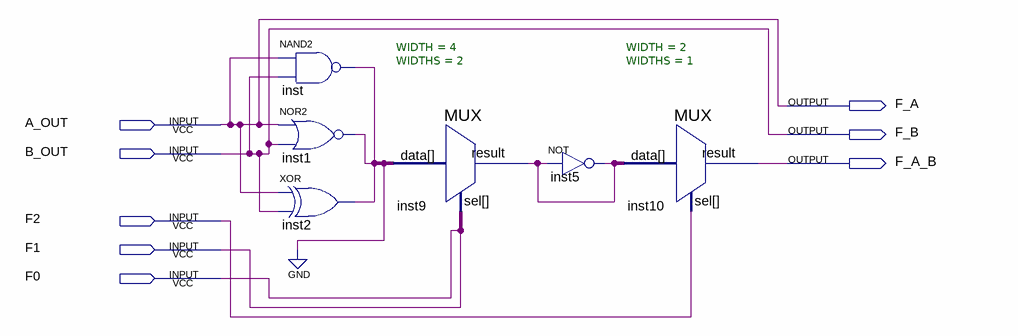
[diagram p0: schematic sheet]
// Quartus schematic ALU.bdf as structural Verilog: 6 symbols, 8 pins
module ALU (
  input  A_OUT,
  input  B_OUT,
  input  F2,
  input  F1,
  input  F0,
  output F_A,
  output F_B,
  output F_A_B
);

  wire inst9_result, inst_out;
  wire [1:0] undriven, undriven_3;
  wire [3:0] undriven_2;

  nand inst (inst_out, A_OUT, B_OUT);
  nor inst1 (inst_out, A_OUT, B_OUT);
  xor inst2 (inst_out, A_OUT, B_OUT);
  MUX #(.WIDTH(4), .WIDTHS(2)) inst9 (.data(undriven_2), .sel(undriven_3), .result(inst9_result));
  not inst5 (inst9_result, inst9_result);
  MUX #(.WIDTH(2), .WIDTHS(1)) inst10 (.data(undriven), .sel(F2), .result(F_A_B));

  assign F_A = A_OUT;
  assign F_B = B_OUT;
endmodule
